# Altium schematic sheet FMC connector.SchDoc
size A3
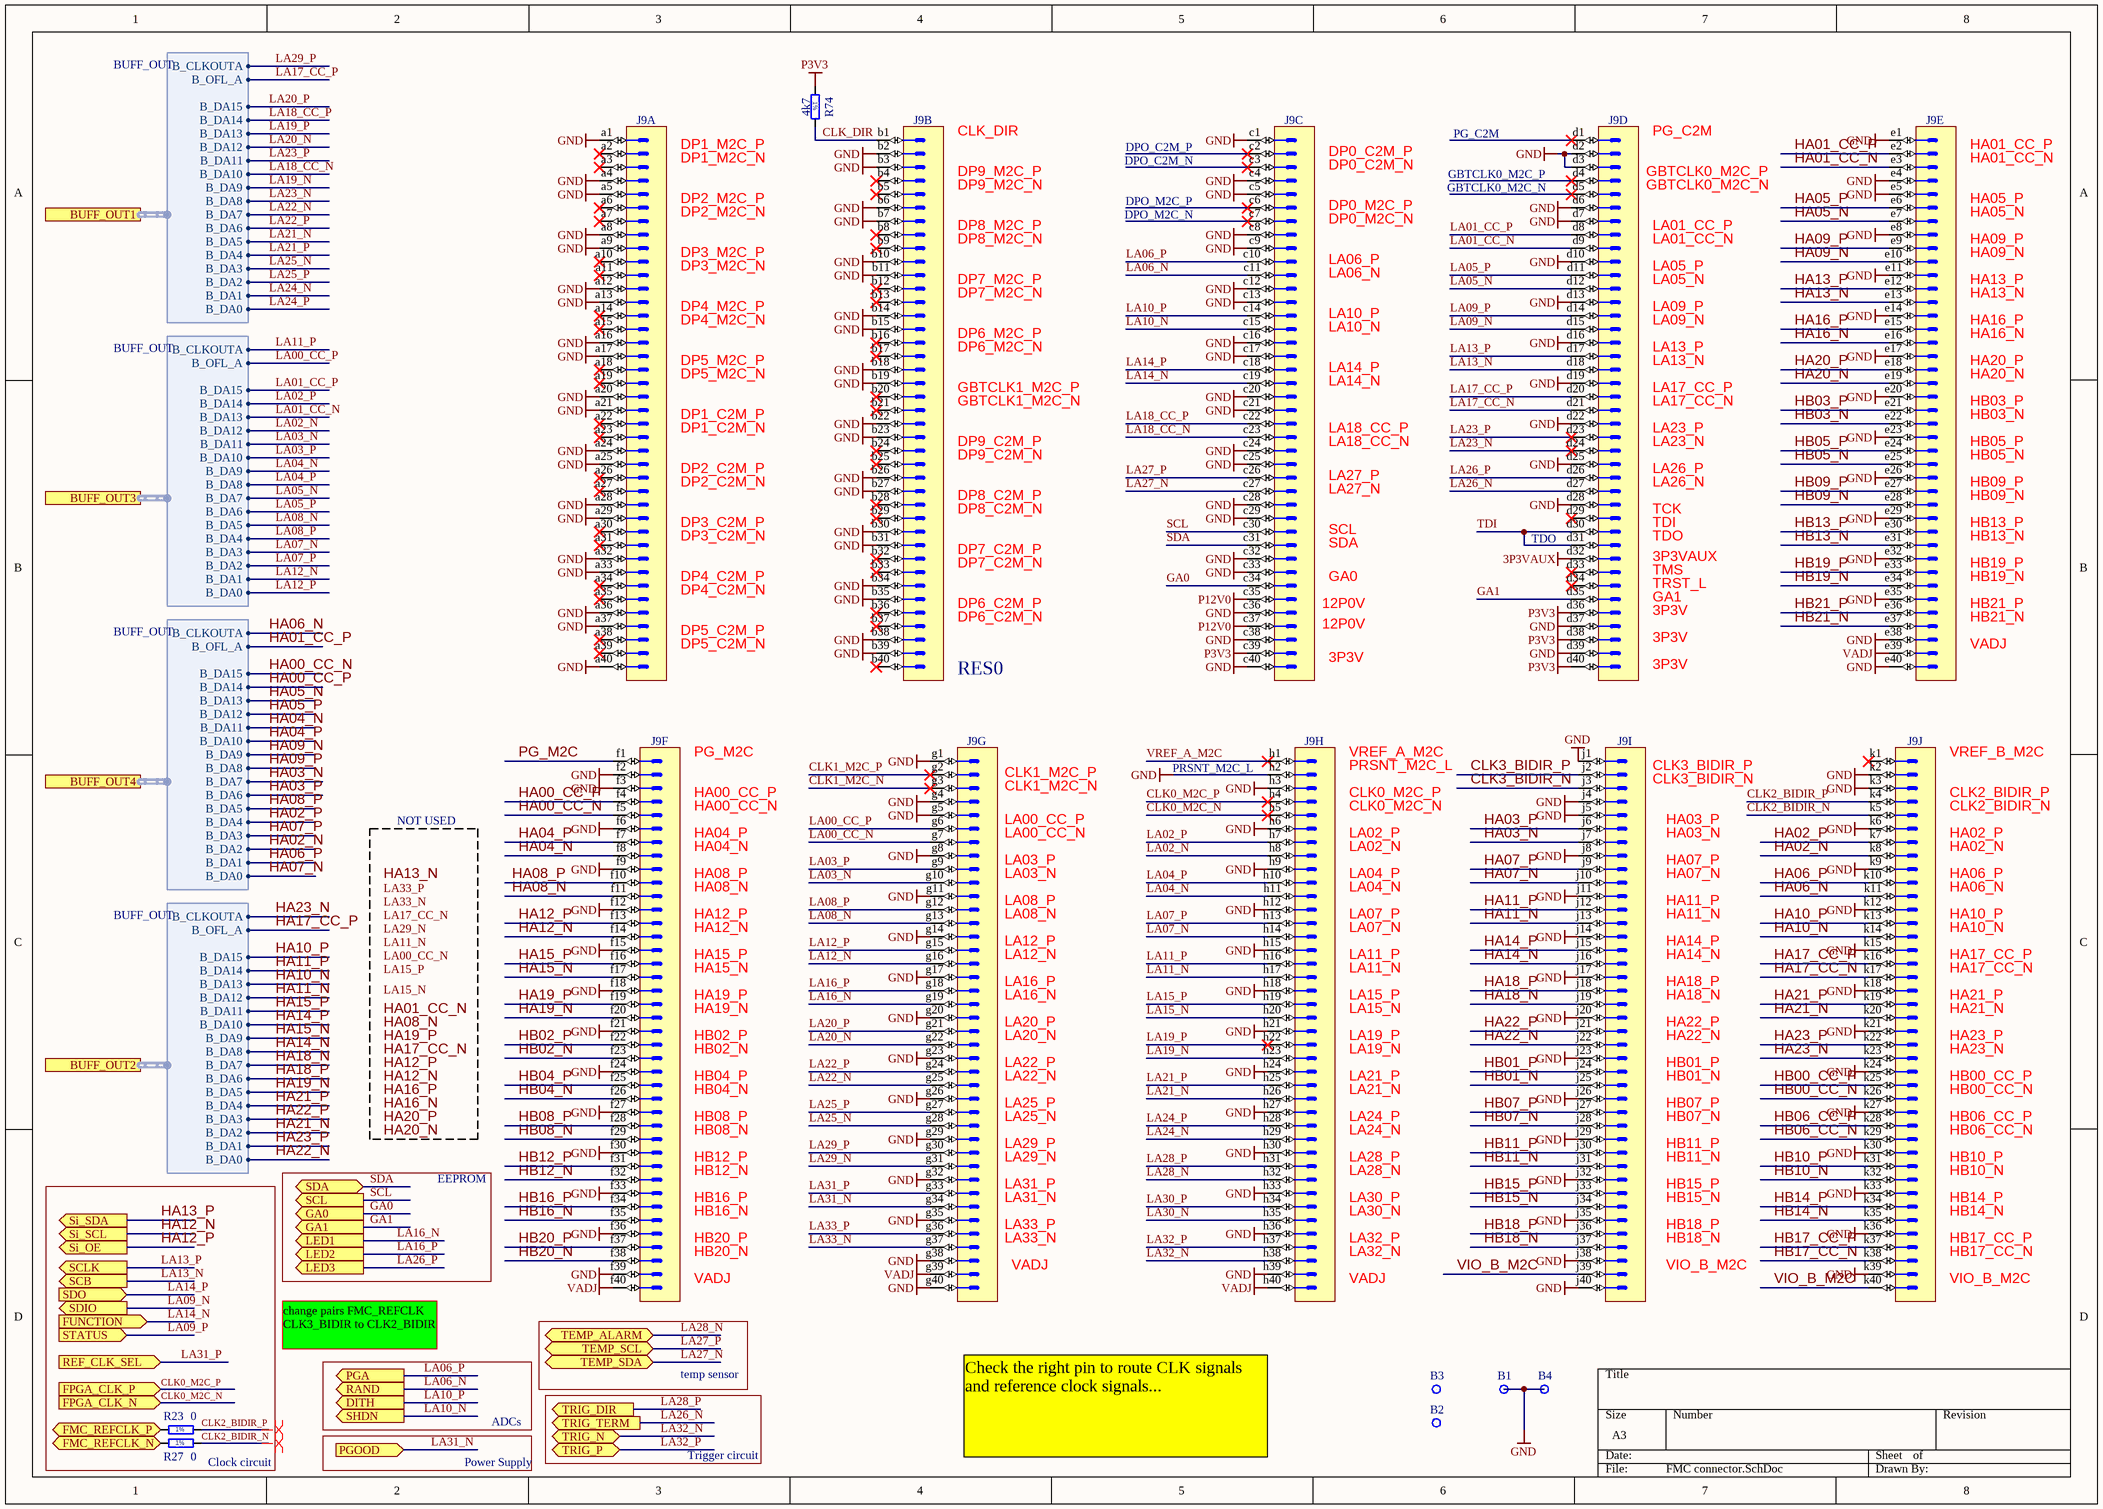
[diagram p0: FMC connector.SchDoc]

## Parts
B1  Plated Hole  [MTG300_600]  (value not drawn)
B2  Plated Hole  [MTG300_600]  (value not drawn)
B3  Plated Hole  [MTG300_600]  (value not drawn)
B4  Plated Hole  [MTG300_600]  (value not drawn)
J9  VITA 57  [SAMTEC_ASP-134488-01]  (value not drawn)  (parts A,B,C,D,E,F,G,H,I,J of 10)
R23  0  [RESC1005X40N]
R27  0  [RESC1005X40N]
R74  4k7  [RESC1608X55N]

## Blocks framed on the sheet
Clock circuit: R23 R27

## Ports
BUFF_OUT1 (harness BUFF_OUT), BUFF_OUT2 (harness BUFF_OUT), BUFF_OUT3 (harness BUFF_OUT), BUFF_OUT4 (harness BUFF_OUT), DITH (out), FMC_REFCLK_N (out), FMC_REFCLK_P (out), FPGA_CLK_N (in), FPGA_CLK_P (in), FUNCTION (in), GA0 (out), GA1 (out), LED1 (out), LED2 (out), LED3 (out), PGA (out), PGOOD (in), RAND (out), REF_CLK_SEL (in), SCB (out), SCL (out), SCLK (out), SDA (bidir), SDIO (out), SDO (in), SHDN (out), Si_OE (out), Si_SCL (out), Si_SDA (out), STATUS (in), TEMP_ALARM (bidir), TEMP_SCL (bidir), TEMP_SDA (bidir), TRIG_DIR (out), TRIG_N (bidir), TRIG_P (bidir), TRIG_TERM (out)

## Harnesses
BUFF_OUT: B_CLKOUTA, B_OFL_A, B_DA0, B_DA1, B_DA2, B_DA3, B_DA4, B_DA5, B_DA6, B_DA7, B_DA8, B_DA9, B_DA10, B_DA11, B_DA12, B_DA13, B_DA14, B_DA15

## Nets
3P3VAUX: J9.d32
GND: B1.1 B4.1 J9.a1 J9.a4 J9.a5 J9.a8 J9.a9 J9.a12 J9.a13 J9.a16 J9.a17 J9.a20 J9.a21 J9.a24 J9.a25 J9.a28 J9.a29 J9.a32 J9.a33 J9.a36 J9.a37 J9.a40 J9.b2 J9.b3 J9.b6 J9.b7 J9.b10 J9.b11 J9.b14 J9.b15 J9.b18 J9.b19 J9.b22 J9.b23 J9.b26 J9.b27 J9.b30 J9.b31 J9.b34 J9.b35 J9.b38 J9.b39 J9.c1 J9.c4 J9.c5 J9.c8 J9.c9 J9.c12 J9.c13 J9.c16 J9.c17 J9.c20 J9.c21 J9.c24 J9.c25 J9.c28 J9.c29 J9.c32 J9.c33 J9.c36 J9.c38 J9.c40 J9.d2 J9.d3 J9.d6 J9.d7 J9.d10 J9.d13 J9.d16 J9.d19 J9.d22 J9.d25 J9.d28 J9.d37 J9.d39 J9.e1 J9.e4 J9.e5 J9.e8 J9.e11 J9.e14 J9.e17 J9.e20 J9.e23 J9.e26 J9.e29 J9.e32 J9.e35 J9.e38 J9.e40 J9.f2 J9.f3 J9.f6 J9.f9 J9.f12 J9.f15 J9.f18 J9.f21 J9.f24 J9.f27 J9.f30 J9.f33 J9.f36 J9.f39 J9.g1 J9.g4 J9.g5 J9.g8 J9.g11 J9.g14 J9.g17 J9.g20 J9.g23 J9.g26 J9.g29 J9.g32 J9.g35 J9.g38 J9.g40 J9.h2 J9.h3 J9.h6 J9.h9 J9.h12 J9.h15 J9.h18 J9.h21 J9.h24 J9.h27 J9.h30 J9.h33 J9.h36 J9.h39 J9.j1 J9.j4 J9.j5 J9.j8 J9.j11 J9.j14 J9.j17 J9.j20 J9.j23 J9.j26 J9.j29 J9.j32 J9.j35 J9.j38 J9.j40 J9.k2 J9.k3 J9.k6 J9.k9 J9.k12 J9.k15 J9.k18 J9.k21 J9.k24 J9.k27 J9.k30 J9.k33 J9.k36 J9.k39
P3V3: J9.c39 J9.d36 J9.d38 J9.d40 R74.1
P12V0: J9.c35 J9.c37
VADJ: J9.e39 J9.f40 J9.g39 J9.h40
CLK0_M2C_N: J9.h5 ; port FPGA_CLK_N
CLK0_M2C_P: J9.h4 ; port FPGA_CLK_P
CLK1_M2C_N: J9.g3
CLK1_M2C_P: J9.g2
CLK2_BIDIR_N: J9.k5 R27.2
CLK2_BIDIR_P: J9.k4 R23.2
CLK3_BIDIR_N: J9.j3
CLK3_BIDIR_P: J9.j2
CLK_DIR: J9.b1 R74.2
FMC_REFCLK_N: R27.1 ; port FMC_REFCLK_N
FMC_REFCLK_P: R23.1 ; port FMC_REFCLK_P
GA0: J9.c34 ; port GA0
GA1: J9.d35 ; port GA1
HA00_CC_N: J9.f5 ; port BUFF_OUT4.B_DA15
HA00_CC_P: J9.f4 ; port BUFF_OUT4.B_DA14
HA01_CC_N: J9.e3
HA01_CC_P: J9.e2 ; port BUFF_OUT4.B_OFL_A
HA02_N: J9.k8 ; port BUFF_OUT4.B_DA2
HA02_P: J9.k7 ; port BUFF_OUT4.B_DA4
HA03_N: J9.j7 ; port BUFF_OUT4.B_DA7
HA03_P: J9.j6 ; port BUFF_OUT4.B_DA6
HA04_N: J9.f8 ; port BUFF_OUT4.B_DA11
HA04_P: J9.f7 ; port BUFF_OUT4.B_DA10
HA05_N: J9.e7 ; port BUFF_OUT4.B_DA13
HA05_P: J9.e6 ; port BUFF_OUT4.B_DA12
HA06_N: J9.k11 ; port BUFF_OUT4.B_CLKOUTA
HA06_P: J9.k10 ; port BUFF_OUT4.B_DA1
HA07_N: J9.j10 ; port BUFF_OUT4.B_DA0
HA07_P: J9.j9 ; port BUFF_OUT4.B_DA3
HA08_N: J9.f11
HA08_P: J9.f10 ; port BUFF_OUT4.B_DA5
HA09_N: J9.e10 ; port BUFF_OUT4.B_DA9
HA09_P: J9.e9 ; port BUFF_OUT4.B_DA8
HA10_N: J9.k14 ; port BUFF_OUT2.B_DA13
HA10_P: J9.k13 ; port BUFF_OUT2.B_DA15
HA11_N: J9.j13 ; port BUFF_OUT2.B_DA12
HA11_P: J9.j12 ; port BUFF_OUT2.B_DA14
HA12_N: J9.f14 ; port Si_SCL
HA12_P: J9.f13 ; port Si_OE
HA13_N: J9.e13
HA13_P: J9.e12 ; port Si_SDA
HA14_N: J9.j16 ; port BUFF_OUT2.B_DA8
HA14_P: J9.j15 ; port BUFF_OUT2.B_DA10
HA15_N: J9.f17 ; port BUFF_OUT2.B_DA9
HA15_P: J9.f16 ; port BUFF_OUT2.B_DA11
HA16_N: J9.e16
HA16_P: J9.e15
HA17_CC_N: J9.k17
HA17_CC_P: J9.k16 ; port BUFF_OUT2.B_OFL_A
HA18_N: J9.j19 ; port BUFF_OUT2.B_DA7
HA18_P: J9.j18 ; port BUFF_OUT2.B_DA6
HA19_N: J9.f20 ; port BUFF_OUT2.B_DA5
HA19_P: J9.f19
HA20_N: J9.e19
HA20_P: J9.e18
HA21_N: J9.k20 ; port BUFF_OUT2.B_DA2
HA21_P: J9.k19 ; port BUFF_OUT2.B_DA4
HA22_N: J9.j22 ; port BUFF_OUT2.B_DA0
HA22_P: J9.j21 ; port BUFF_OUT2.B_DA3
HA23_N: J9.k23 ; port BUFF_OUT2.B_CLKOUTA
HA23_P: J9.k22 ; port BUFF_OUT2.B_DA1
HB00_CC_N: J9.k26
HB00_CC_P: J9.k25
HB01_N: J9.j25
HB01_P: J9.j24
HB02_N: J9.f23
HB02_P: J9.f22
HB03_N: J9.e22
HB03_P: J9.e21
HB04_N: J9.f26
HB04_P: J9.f25
HB05_N: J9.e25
HB05_P: J9.e24
HB06_CC_N: J9.k29
HB06_CC_P: J9.k28
HB07_N: J9.j28
HB07_P: J9.j27
HB08_N: J9.f29
HB08_P: J9.f28
HB09_N: J9.e28
HB09_P: J9.e27
HB10_N: J9.k32
HB10_P: J9.k31
HB11_N: J9.j31
HB11_P: J9.j30
HB12_N: J9.f32
HB12_P: J9.f31
HB13_N: J9.e31
HB13_P: J9.e30
HB14_N: J9.k35
HB14_P: J9.k34
HB15_N: J9.j34
HB15_P: J9.j33
HB16_N: J9.f35
HB16_P: J9.f34
HB17_CC_N: J9.k38
HB17_CC_P: J9.k37
HB18_N: J9.j37
HB18_P: J9.j36
HB19_N: J9.e34
HB19_P: J9.e33
HB20_N: J9.f38
HB20_P: J9.f37
HB21_N: J9.e37
HB21_P: J9.e36
LA00_CC_N: J9.g7
LA00_CC_P: J9.g6 ; port BUFF_OUT3.B_OFL_A
LA01_CC_N: J9.d9 ; port BUFF_OUT3.B_DA13
LA01_CC_P: J9.d8 ; port BUFF_OUT3.B_DA15
LA02_N: J9.h8 ; port BUFF_OUT3.B_DA12
LA02_P: J9.h7 ; port BUFF_OUT3.B_DA14
LA03_N: J9.g10 ; port BUFF_OUT3.B_DA11
LA03_P: J9.g9 ; port BUFF_OUT3.B_DA10
LA04_N: J9.h11 ; port BUFF_OUT3.B_DA9
LA04_P: J9.h10 ; port BUFF_OUT3.B_DA8
LA05_N: J9.d12 ; port BUFF_OUT3.B_DA7
LA05_P: J9.d11 ; port BUFF_OUT3.B_DA6
LA06_N: J9.c11 ; port RAND
LA06_P: J9.c10 ; port PGA
LA07_N: J9.h14 ; port BUFF_OUT3.B_DA3
LA07_P: J9.h13 ; port BUFF_OUT3.B_DA2
LA08_N: J9.g13 ; port BUFF_OUT3.B_DA5
LA08_P: J9.g12 ; port BUFF_OUT3.B_DA4
LA09_N: J9.d15 ; port SDIO
LA09_P: J9.d14 ; port STATUS
LA10_N: J9.c15 ; port SHDN
LA10_P: J9.c14 ; port DITH
LA11_N: J9.h17
LA11_P: J9.h16 ; port BUFF_OUT3.B_CLKOUTA
LA12_N: J9.g16 ; port BUFF_OUT3.B_DA1
LA12_P: J9.g15 ; port BUFF_OUT3.B_DA0
LA13_N: J9.d18 ; port SCB
LA13_P: J9.d17 ; port SCLK
LA14_N: J9.c19 ; port FUNCTION
LA14_P: J9.c18 ; port SDO
LA15_N: J9.h20
LA15_P: J9.h19
LA16_N: J9.g19 ; port LED1
LA16_P: J9.g18 ; port LED2
LA17_CC_N: J9.d21
LA17_CC_P: J9.d20 ; port BUFF_OUT1.B_OFL_A
LA18_CC_N: J9.c23 ; port BUFF_OUT1.B_DA10
LA18_CC_P: J9.c22 ; port BUFF_OUT1.B_DA14
LA19_N: J9.h23 ; port BUFF_OUT1.B_DA9
LA19_P: J9.h22 ; port BUFF_OUT1.B_DA13
LA20_N: J9.g22 ; port BUFF_OUT1.B_DA12
LA20_P: J9.g21 ; port BUFF_OUT1.B_DA15
LA21_N: J9.h26 ; port BUFF_OUT1.B_DA5
LA21_P: J9.h25 ; port BUFF_OUT1.B_DA4
LA22_N: J9.g25 ; port BUFF_OUT1.B_DA7
LA22_P: J9.g24 ; port BUFF_OUT1.B_DA6
LA23_N: J9.d24 ; port BUFF_OUT1.B_DA8
LA23_P: J9.d23 ; port BUFF_OUT1.B_DA11
LA24_N: J9.h29 ; port BUFF_OUT1.B_DA1
LA24_P: J9.h28 ; port BUFF_OUT1.B_DA0
LA25_N: J9.g28 ; port BUFF_OUT1.B_DA3
LA25_P: J9.g27 ; port BUFF_OUT1.B_DA2
LA26_N: J9.d27 ; port TRIG_TERM
LA26_P: J9.d26 ; port LED3
LA27_N: J9.c27 ; port TEMP_SDA
LA27_P: J9.c26 ; port TEMP_SCL
LA28_N: J9.h32 ; port TEMP_ALARM
LA28_P: J9.h31 ; port TRIG_DIR
LA29_N: J9.g31
LA29_P: J9.g30 ; port BUFF_OUT1.B_CLKOUTA
LA30_N: J9.h35
LA30_P: J9.h34
LA31_N: J9.g34 ; port PGOOD
LA31_P: J9.g33 ; port REF_CLK_SEL
LA32_N: J9.h38 ; port TRIG_N
LA32_P: J9.h37 ; port TRIG_P
LA33_N: J9.g37
LA33_P: J9.g36
PG_M2C: J9.f1
SCL: J9.c30 ; port SCL
SDA: J9.c31 ; port SDA
TDI: J9.d30 J9.d31
VIO_B_M2C: J9.j39 J9.k40
VREF_A_M2C: J9.h1

Not connected (* = marked no-connect by the designer): B2 1; B3 1; J9 a2* a3* a6* a7* a10* a11* a14* a15* a18* a19* a22* a23* a26* a27* a30* a31* a34* a35* a38* a39* b4* b5* b8* b9* b12* b13* b16* b17* b20* b21* b24* b25* b28* b29* b32* b33* b36* b37* b40* c2* c3* c6* c7* d1* d4* d5* d29* d33* d34* k1*

## Layout directives
differential pair: CLK2_BIDIR_N, CLK2_BIDIR_P

## Notes on the sheet
- DP1_M2C_P
- DP1_M2C_N
- CLK_DIR
- DP9_M2C_P
- DPO_C2M_P
- DPO_C2M_N
- DP0_C2M_P
- DP0_C2M_N
- PG_C2M
- GBTCLK0_M2C_P
- GBTCLK0_M2C_N
- (near J9) GBTCLK0_M2C_P
- HA01_CC_P
- HA01_CC_N
- DP2_M2C_P
- DP2_M2C_N
- DP9_M2C_N
- DP8_M2C_P
- DP8_M2C_N
- DPO_M2C_P
- DPO_M2C_N
- DP0_M2C_P
- DP0_M2C_N
- (near J9) GBTCLK0_M2C_N
- LA01_CC_P
- LA01_CC_N
- HA05_P
- HA05_N
- HA09_P
- DP3_M2C_P
- DP3_M2C_N
- DP4_M2C_P
- DP7_M2C_P
- DP7_M2C_N
- LA06_P
- LA06_N
- LA10_P
- LA05_P
- LA05_N
- LA09_P
- HA09_N
- HA13_P
- HA13_N
- DP4_M2C_N
- DP5_M2C_P
- DP5_M2C_N
- DP6_M2C_P
- DP6_M2C_N
- LA10_N
- LA14_P
- LA09_N
- LA13_P
- LA13_N
- HA16_P
- HA16_N
- HA20_P
- HA20_N
- DP1_C2M_P
- DP1_C2M_N
- GBTCLK1_M2C_P
- GBTCLK1_M2C_N
- DP9_C2M_P
- LA14_N
- LA18_CC_P
- LA18_CC_N
- LA17_CC_P
- LA17_CC_N
- LA23_P
- LA23_N
- HB03_P
- HB03_N
- HB05_P
- DP2_C2M_P
- DP2_C2M_N
- DP9_C2M_N
- DP8_C2M_P
- DP8_C2M_N
- LA27_P
- LA27_N
- LA26_P
- LA26_N
- TCK
- HB05_N
- HB09_P
- HB09_N
- DP3_C2M_P
- DP3_C2M_N
- DP4_C2M_P
- DP7_C2M_P
- DP7_C2M_N
- SCL
- SDA
- GA0
- (near J9) TDO
- TDI
- TDO
- 3P3VAUX
- TMS
- TRST_L
- HB13_P
- HB13_N
- HB19_P
- HB19_N
- DP4_C2M_N
- DP5_C2M_P
- DP5_C2M_N
- DP6_C2M_P
- DP6_C2M_N
- (near J9) 12P0V
- GA1
- 3P3V
- HB21_P
- HB21_N
- VADJ
- RES0
- PG_M2C
- (near J9) CLK1_M2C_P
- (near J9) PRSNT_M2C_L
- VREF_A_M2C
- PRSNT_M2C_L
- (near J9) CLK3_BIDIR_P
- (near J9) CLK3_BIDIR_N
- VREF_B_M2C
- NOT USED
- HA00_CC_P
- HA00_CC_N
- HA04_P
- HA04_N
- (near J9) CLK1_M2C_N
- (near J9) LA00_CC_P
- (near J9) LA00_CC_N
- CLK0_M2C_P
- CLK0_M2C_N
- LA02_P
- LA02_N
- HA03_P
- HA03_N
- CLK2_BIDIR_P
- CLK2_BIDIR_N
- HA02_P
- HA02_N
- HA08_P
- HA08_N
- HA12_P
- (near J9) LA03_P
- (near J9) LA03_N
- (near J9) LA08_P
- (near J9) LA08_N
- LA04_P
- LA04_N
- LA07_P
- HA07_P
- HA07_N
- HA11_P
- HA11_N
- HA06_P
- HA06_N
- HA10_P
- HA12_N
- HA15_P
- HA15_N
- (near J9) LA12_P
- (near J9) LA12_N
- (near J9) LA16_P
- LA07_N
- LA11_P
- LA11_N
- HA14_P
- HA14_N
- HA18_P
- HA10_N
- HA17_CC_P
- HA17_CC_N
- HA19_P
- HA19_N
- HB02_P
- HB02_N
- (near J9) LA16_N
- (near J9) LA20_P
- (near J9) LA20_N
- LA15_P
- LA15_N
- LA19_P
- LA19_N
- HA18_N
- HA22_P
- HA22_N
- HA21_P
- HA21_N
- HA23_P
- HA23_N
- HB04_P
- HB04_N
- HB08_P
- (near J9) LA22_P
- (near J9) LA22_N
- (near J9) LA25_P
- (near J9) LA25_N
- LA21_P
- LA21_N
- LA24_P
- HB01_P
- HB01_N
- HB07_P
- HB07_N
- HB00_CC_P
- HB00_CC_N
- HB06_CC_P
- EEPROM
- HB08_N
- HB12_P
- HB12_N
- (near J9) LA29_P
- (near J9) LA29_N
- (near J9) LA31_P
- LA24_N
- LA28_P
- LA28_N
- HB11_P
- HB11_N
- HB15_P
- HB06_CC_N
- HB10_P
- HB10_N
- HB16_P
- HB16_N
- HB20_P
- HB20_N
- (near J9) LA31_N
- (near J9) LA33_P
- (near J9) LA33_N
- LA30_P
- LA30_N
- LA32_P
- LA32_N
- HB15_N
- HB18_P
- HB18_N
- HB14_P
- HB14_N
- HB17_CC_P
- HB17_CC_N
- VIO_B_M2C
- change pairs FMC_REFCLK CLK3_BIDIR to CLK2_BIDIR
- temp sensor
- ADCs
- Trigger circuit
- Check the right pin to route CLK signals and reference clock signals...
- Power Supply
- Labels drawn without touching a wire or pin: HA01_CC_N, HA08_N, HA12_N, HA12_P, HA13_N, HA16_N, HA16_P, HA17_CC_N, HA19_P, HA20_N, HA20_P, LA00_CC_N, LA11_N, LA15_N, LA15_P, LA17_CC_N, LA29_N, LA33_N, LA33_P
- (in symbol R0402_0R_JUMPER) 1%
- (in symbol R0603_4K7_1%_0.1W_100PPM) 1%

## Library data of the parts
B1-B4 = PLATED_HOLE3.0_PAD6.0: Single Terminal Socket; Part Description: Plated Through Hole: Hole Dia.=3.0mm Pad Dia.=6.0mm; Mounted: No; Table: Pads; Part Number: PLATED_HOLE3.0_PAD6.0; Component Kind: Standard (No BOM); Component Type: Standard (No BOM); Designator: Single Terminal Socket; Library Reference: Single Terminal Socket; Pin Count: 1; Family: Plated Hole; Socket: No; SMD: No; Status: None; ComponentHeight: 0mm; Author: CERN DEM JLC; CreateDate: 26.05.2008; LatestRevisionDate: 26.05.2008; PackageDescription: Plated Through Hole: Hole Dia.=3.0mm Pad Dia.=6.0mm
J9 = SAMTEC_ASP-134488-01: Connector VITA 57, 400 Male contacts in 10 row abcdefghj; Part Description: 400 contacts (10 rows abcdefghj) Surface Mount Male Connector, VITA 57 (MC-HPC-10); Manufacturer: SAMTEC; Part Number: SAMTEC_ASP-134488-01; Component Kind: Standard; Component Type: Standard; Pin Count: 400; Family: VITA 57; Mounted: Yes; Socket: No; SMD: Yes; Status: None; Manufacturer Part Number: ASP-134488-01; ComponentHeight: 6.1mm; HelpURL: \\cern.ch\dfs\Applications\Altium\Datasheets\SAMTEC_ASP-134488-01.pdf; Author: CERN DEM JLC; CreateDate: 30/04/2009; LatestRevisionDate: 17/08/2009; Table: SAMTEC
R23 R27 = R0402_0R_JUMPER: Resistor - 1%; Part Description: 1A (0.05R Max DC Resistance) Zero Ohm Jumper; Manufacturer: GENERIC; Manufacturer1 Part Number: 232270591001L; Table: Resistors SMD; Part Number: R0402_0R_JUMPER; Component Kind: Standard; Component Type: Standard; Pin Count: 2; Value: 0; Status: Not recommended; Manufacturer Part Number: R0402_0R_JUMPER; Case: 0402; Mounted: Yes; Socket: No; SMD: Yes; Manufacturer1 Example: YAGEO PHYCOMP; Manufacturer1 ComponentHeight: 0.4mm; HelpURL: \\cern.ch\dfs\Applications\Altium\Datasheets\R0402_Phycomp_RC0402.pdf; Author: CERN DEM JLC; CreateDate: 3/12/2007; LatestRevisionDate: 17/10/2012
R74 = R0603_4K7_1%_0.1W_100PPM: Resistor - 1%; Part Description: General Purpose Thick Film Chip Resistor; Manufacturer: GENERIC; Manufacturer1 Part Number: NRC06F4701TRF; Power: 0.1W; TC: ±100ppm/°C; Table: Resistors SMD; Part Number: R0603_4K7_1%_0.1W_100PPM; Component Kind: Standard; Component Type: Standard; Pin Count: 2; Value: 4k7; Status: Preferred; Tolerance: ±1%; Manufacturer Part Number: R0603_4K7_1%_0.1W_100PPM; Case: 0603; Mounted: Yes; Socket: No; SMD: Yes; Manufacturer1 Example: NIC COMPONENT; Manufacturer1 ComponentHeight: 0.55mm; HelpURL: \\cern.ch\dfs\Applications\Altium\Datasheets\R0603_NIC_NRC.pdf; Author: CERN DEM JLC; CreateDate: 03/12/2007; LatestRevisionDate: 13/03/2008